# EAGLE design shield-i2c-santa (EAGLE 6.5.0)
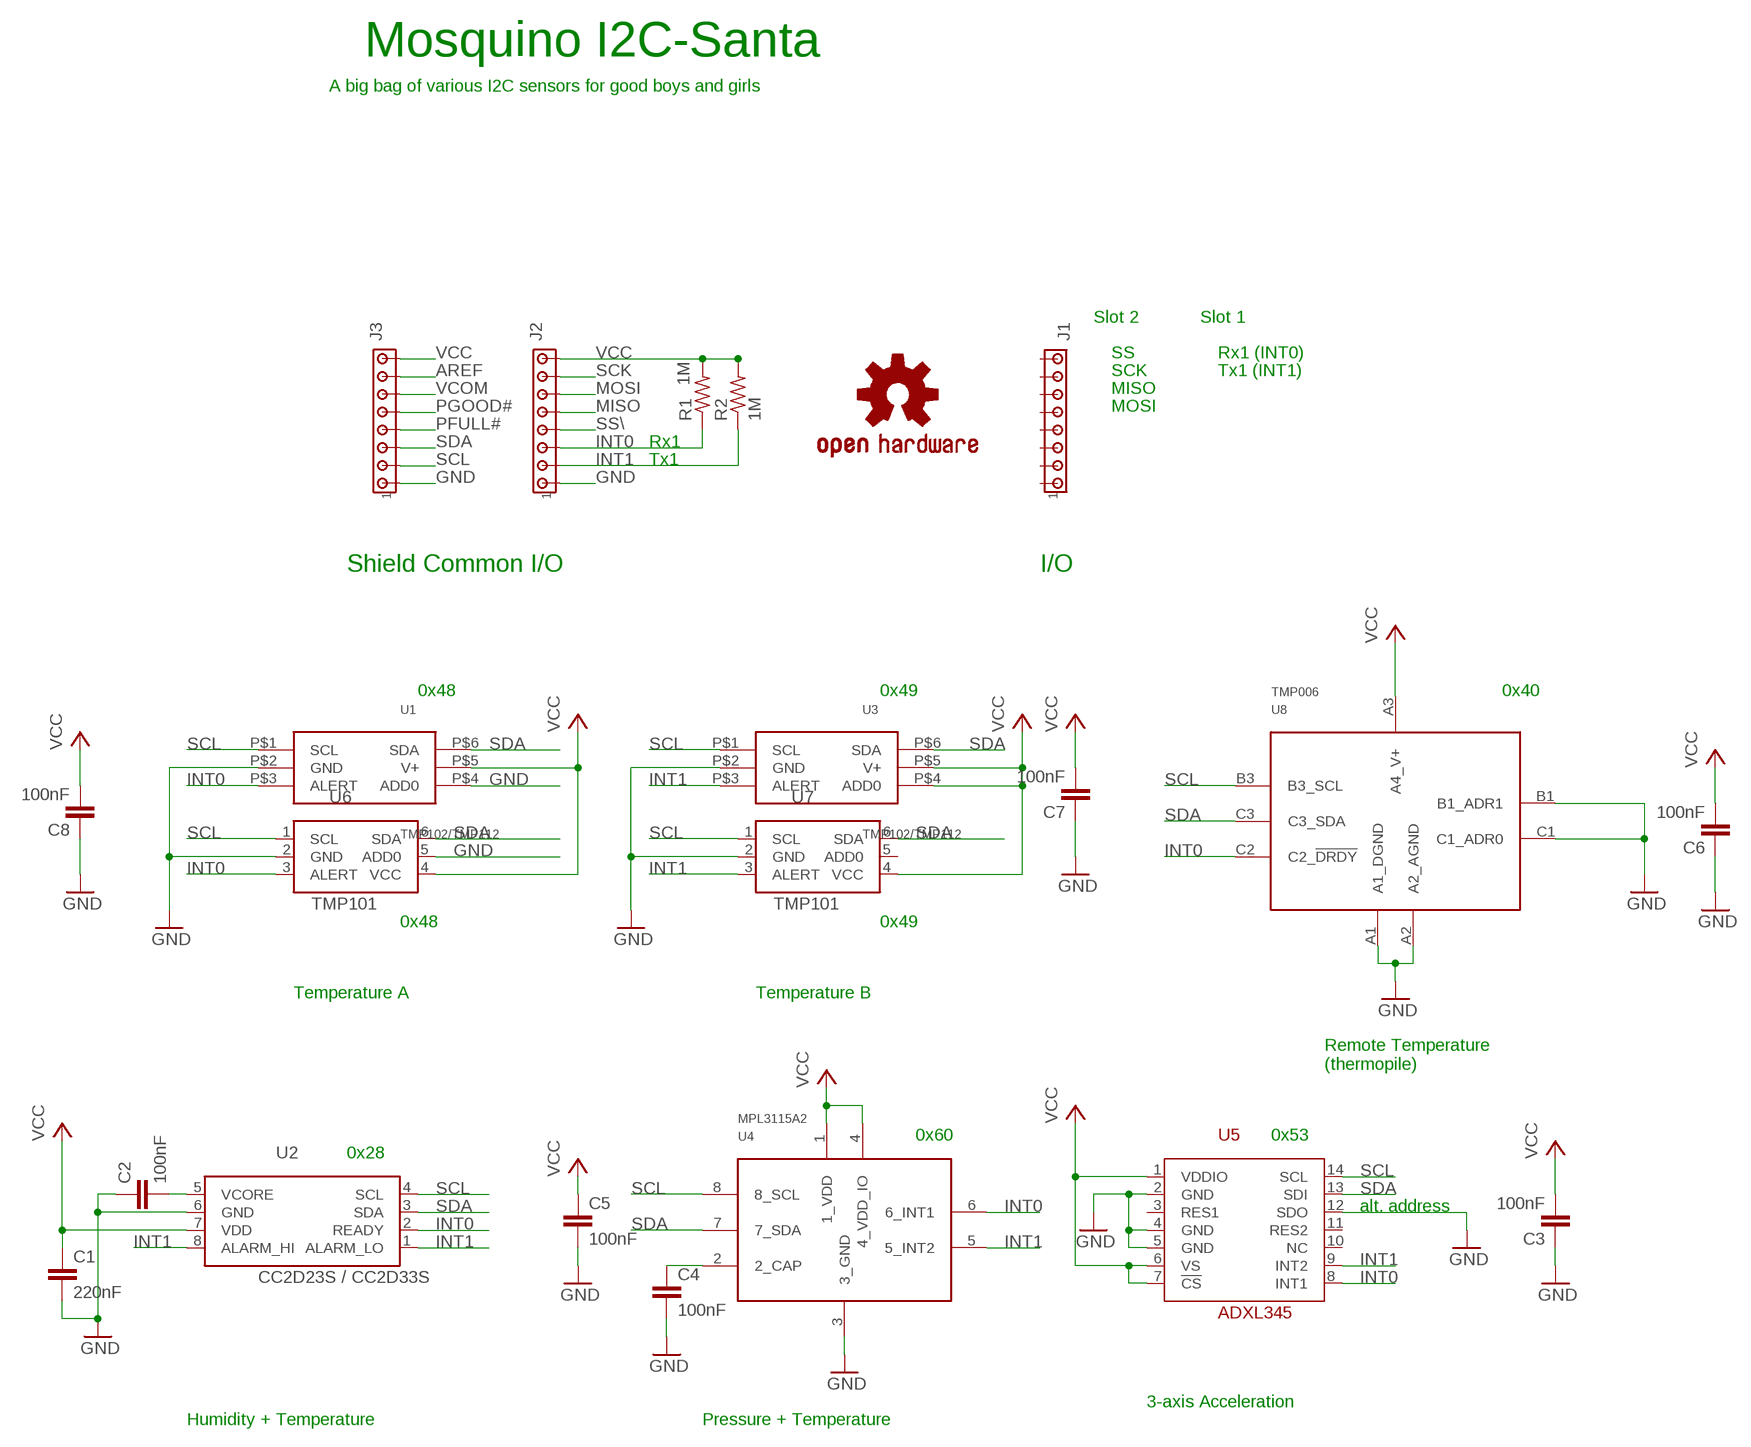
[diagram p0: schematic, sheet 1]

## Parts
C1  220nF  C-EUC0603  [C0603]
C2  100nF  C-EUC0603  [C0603]
C3  100nF  C-EUC0603  [C0603]
C4  100nF  C-EUC0603  [C0603]
C5  100nF  C-EUC0603  [C0603]
C6  100nF  C-EUC0603  [C0603]
C7  100nF  C-EUC0603  [C0603]
C8  100nF  C-EUC0603  [C0603]
J1  MTA08-100  [10X08MTA]
J2  MTA08-100  [10X08MTA]
J3  MTA08-100  [10X08MTA]
LOGO1  OSHW-LOGOS  [OSHW-LOGO-S]
R1  1M  R-US_R0603  [R0603]
R2  1M  R-US_R0603  [R0603]
U1  TMP102/TMP112  TMP102  [SOT563]
U2  CC2D23S / CC2D33S  CC2DXXX  [CC2DXXX]
U3  TMP102/TMP112  TMP102  [SOT563]
U4  MPL3115A2  [8-LGA]
U5  ADXL345  [14-LGA]
U6  TMP101  [SOT23-6]
U7  TMP101  [SOT23-6]
U8  TMP006  [8-DSBGA]

## Nets
AREF: J3.7
GND: C1.2 C2.1 C3.1 C4.2 C5.2 C6.1 C7.1 C8.1 J2.1 J3.1 U1.P$2(GND) U1.P$4(ADD0) U2.6(GND) U3.P$2(GND) U4.3(3_GND) U5.2(GND) U5.4(GND) U5.5(GND) U5.12(SDO) U6.2(GND) U6.5(ADD0) U7.2(GND) U8.A1(A1_DGND) U8.A2(A2_AGND) U8.B1(B1_ADR1) U8.C1(C1_ADR0)
INT0: J2.3 R1.1 U1.P$3(ALERT) U2.2(READY) U4.6(6_INT1) U5.8(INT1) U6.3(ALERT) U8.C2(C2_!DRDY)
INT1: J2.2 R2.1 U2.1(ALARM_LO) U2.8(ALARM_HI) U3.P$3(ALERT) U4.5(5_INT2) U5.9(INT2) U7.3(ALERT)
MISO: J2.5
MOSI: J2.6
N$1: C2.2 U2.5(VCORE)
N$2: C4.1 U4.2(2_CAP)
PFULL#: J3.4
PGOOD#: J3.5
SCK: J2.7
SCL: J3.2 U1.P$1(SCL) U2.4(SCL) U3.P$1(SCL) U4.8(8_SCL) U5.14(SCL) U6.1(SCL) U7.1(SCL) U8.B3(B3_SCL)
SDA: J3.3 U1.P$6(SDA) U2.3(SDA) U3.P$6(SDA) U4.7(7_SDA) U5.13(SDI) U6.6(SDA) U7.6(SDA) U8.C3(C3_SDA)
SS\: J2.4
VCC: C1.1 C3.2 C5.1 C6.2 C7.2 C8.2 J2.8 J3.8 R1.2 R2.2 U1.P$5(V+) U2.7(VDD) U3.P$4(ADD0) U3.P$5(V+) U4.1(1_VDD) U4.4(4_VDD_IO) U5.1(VDDIO) U5.6(VS) U5.7(!CS) U6.4(VCC) U7.4(VCC) U8.A3(A4_V+)
VCOM: J3.6
Unconnected: J1.1 J1.2 J1.3 J1.4 J1.5 J1.6 J1.7 J1.8 U5.3(RES1) U5.10(NC) U5.11(RES2) U7.5(ADD0)

## Notes on the sheet
- Mosquino I2C-Santa
- A big bag of various I2C sensors for good boys and girls
- Slot 2 | Slot 1
- SS | Rx1 (INT0)
- SCK | Tx1 (INT1)
- MISO
- MOSI
- Rx1
- Tx1
- Shield Common I/O | I/O
- 0x48 | 0x49 | 0x40
- 0x48 | 0x49
- Temperature A | Temperature B
- Remote Temperature
  (thermopile)
- 0x60 | 0x53
- 0x28
- alt. address
- 3-axis Acceleration
- Humidity + Temperature | Pressure + Temperature

## Library data of the parts
C1-C8 = rcl:C-EU: CAPACITOR, European symbol
J1-J3 = con-amp:MTA08-100: AMP connector
LOGO1 = SparkFun-Aesthetics:OSHW-LOGO: Open Source Hardware Logo This logo indicates the piece of hardware it is found on incorporates a OSHW license and/or adheres to the definition of open source hardware found here: http://freedomdefined.org/OSHW
R1 R2 = rcl:R-US_: RESISTOR, American symbol
U1 U3 = tim:TMP102
U2 = tim:CC2DXXX: GE ChipCap series humidity and temperature sensor. 20130911 / tgipson
U4 = tim:MPL3115A2: MPL3115A2 I2C Precision Altimeter Freescale Semiconductor 2013.1.24 MMB
U5 = tim:ADXL345: ADXL345 3-axis digital accelerometer . selectable 2g to 16g scale . in 14-LGA. 20091026 / tgipson
U6 U7 = tim:TMP101: TI TMP100 / TMP101 digital I2C temperature sensor in SOT23-6. 20130912 / tgipson
U8 = tim:TMP006: 8-DSBGA for TI TMP006 Thermopile temperature sensor WARNING - This part requires very specific routing, refer to the following for guidelines: <http://www.ti.com/lit/ug/sbou108/sbou108.pdf> 2013.1.24 MMB

## Net classes
1 pwr: width 0.305 mm, drill 0.508 mm, clearance 0.203 mm
4 digital: width 0.203 mm, drill 0.381 mm, clearance 0.203 mm

## Board
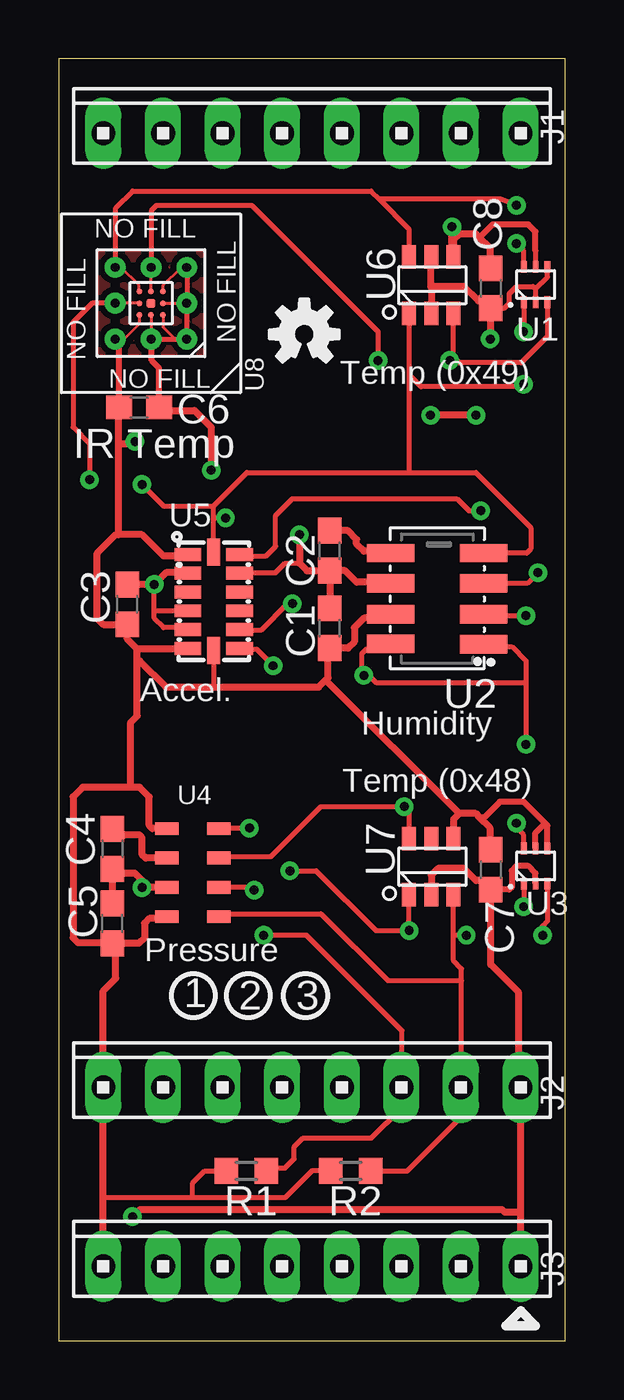
[diagram p1: board, top side]
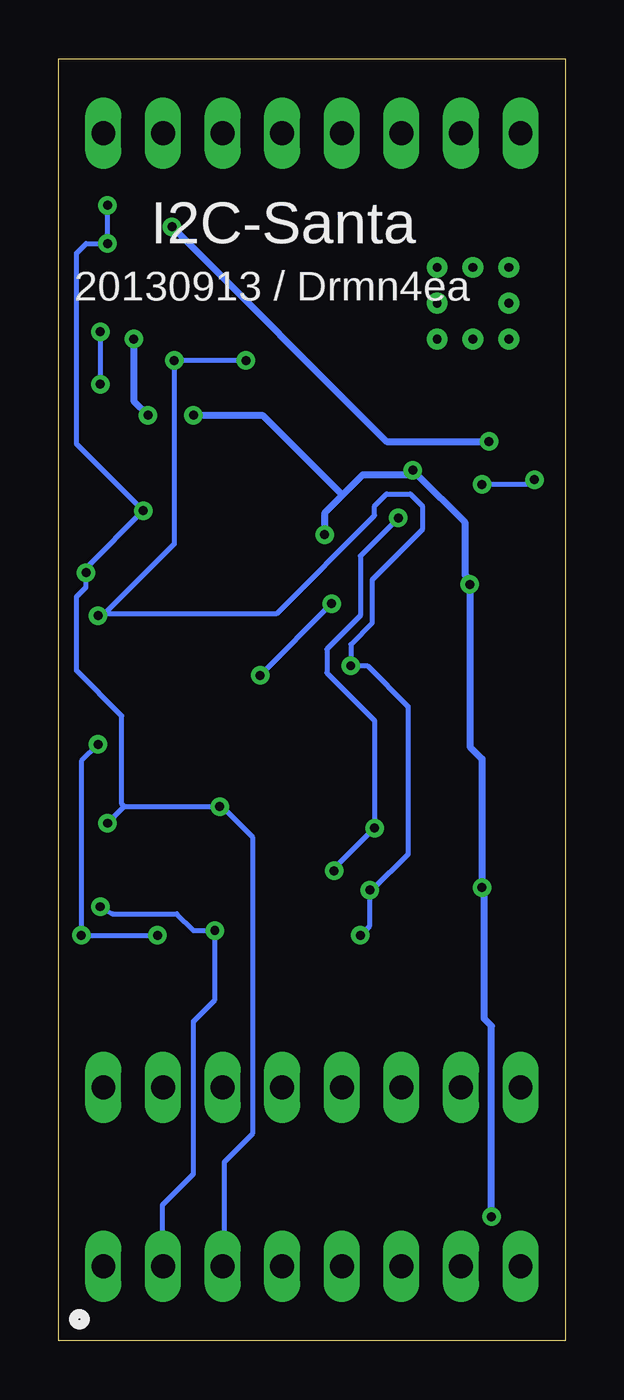
[diagram p2: board, bottom side, seen from below]

Size 21.59 x 54.61 mm. Coordinates in mm from the lower left corner, seen from the top.
Outline: 0,0 21.59,0 21.59,54.61 0,54.61 0,0
Copper layers (1*16): Top 0.035mm / dielectric 1.5mm / Bottom 0.035mm
Design rules "default *": minimum track width 8mil, minimum drill 15mil, track to track 10mil, track to pad 10mil, pad to pad 10mil, via to via 10mil, smd to smd 8mil, copper to edge 15mil, drill to drill 8mil, minimum pad ring 10mil, minimum via ring 8mil, stop-mask expansion 4mil, vias tented up to drill 0mil, thermal gap 10mil

### Footprints (pad centres in the part's own frame; a part is rotated, then mirrored left to right if it is on the bottom)
C0603 = smd 1.1 x 1: 1 -0.85,0; 2 0.85,0
10X08MTA = drill 1.016 long: 1 8.89,0; 2 6.35,0; 3 3.81,0; 4 1.27,0; 5 -1.27,0; 6 -3.81,0; 7 -6.35,0; 8 -8.89,0
R0603 = smd 1 x 1.1: 1 -0.85,0; 2 0.85,0
SOT563 = smd 0.25 x 0.5: P$1 -0.497,-0.718; P$2 0.003,-0.718; P$3 0.503,-0.718; P$4 0.503,0.782; P$5 0.003,0.782; P$6 -0.497,0.782
CC2DXXX = smd 2.007 x 0.787: 1 1.981,-1.956; 2 1.981,-0.686; 3 1.981,0.635; 4 1.981,1.93; 5 -1.981,1.93; 6 -1.981,0.635; 7 -1.981,-0.686; 8 -1.981,-1.93
8-LGA = smd 1 x 0.55: 1 -1.1,1.875; 2 -1.1,0.625; 3 -1.1,-0.625; 4 -1.1,-1.875; 5 1.1,-1.875; 6 1.1,-0.625; 7 1.1,0.625; 8 1.1,1.875
14-LGA = smd 1.145 x 0.55: 1 -1.1,2; 2 -1.1,1.2; 3 -1.1,0.4; 4 -1.1,-0.4; 5 -1.1,-1.2; 6 -1.1,-2; 8 1.1,-2; 9 1.1,-1.2; 10 1.1,-0.4; 11 1.1,0.4; 12 1.1,1.2; 13 1.1,2 | smd 0.55 x 1.145: 7 0,-2.1; 14 0,2.1
SOT23-6 = smd 0.6 x 1: 1 -0.95,-1.2; 2 0,-1.2; 3 0.95,-1.2; 4 0.95,1.2; 5 0,1.2; 6 -0.95,1.2
8-DSBGA = smd 0.635 x 0.635: A1 1.562,-1.521; A2 0,-1.527; A3 -1.532,-1.542; B1 1.539,0.008; B3 -1.527,-0.013; C1 1.547,1.539; C2 0.01,1.529; C3 -1.524,1.532 | smd 0.254 x 0.254: A1_ 0.5,-0.5; A2_ 0,-0.5; A3_ -0.5,-0.5; B1_ 0.5,0; B3_ -0.5,0; C1_ 0.5,0.5; C2_ 0,0.5; C3_ -0.5,0.5 | smd 0.381 x 0.381: B2_ 0,0 | drill 0.381 pad 0.762: VIA_A1 1.524,-1.524; VIA_A2 0,-1.524; VIA_A3 -1.524,-1.524; VIA_B1 1.524,0; VIA_B3 -1.524,0; VIA_C1 1.524,1.524; VIA_C2 0,1.524; VIA_C3 -1.524,1.524

### Placement (x,y rotation side)
C1  11.56,30.35 90 top
C2  11.56,33.66 90 top
C3  2.92,31.37 270 top
C4  2.29,20.95 270 top
C5  2.29,17.78 90 top
C6  3.43,39.75 180 top
C7  18.41,20.07 90 top
C8  18.41,44.83 90 top
J1  10.79,51.44 0 top
J2  10.79,10.79 0 top
J3  10.79,3.17 0 top
LOGO1  10.46,42.88 0 top
R1  8,7.24 180 top
R2  12.45,7.24 180 top
U1  20.32,44.96 0 top
U2  16.13,31.62 0 top
U3  20.32,20.19 0 top
U4  5.71,19.94 0 top
U5  6.6,31.5 0 top
U6  15.88,44.96 0 top
U7  15.88,20.19 0 top
U8  3.94,44.2 0 top

### Tracks (layer width: path | path; a pad name or v marks a point on that pad's centre or on a via)
GND  (via drill 0.38)
  Top 0.203: U5.5 5.42,30.38 4.47,30.38 4.08,30.77 4.08,31.09 | 4.08,31.09 v4.08,32.22 | U5.4 4.08,31.09 | U1.P$2 20.32,44.8 20.32,44.81 | 20.32,44.81 20.82,45.31 U1.P$4 | C8.1 18.43,43.99 19,43.99 19.2,44.2 19.2,44.6 19.51,44.91 20.22,44.91 20.32,44.81 | U5.12 7.72,32.72 9.25,32.72 9.65,33.12 10.26,33.12 | 3.96,42.64 3.99,42.67 U8.A1 5.48,42.7 U8.B1 U8.C1
  Top 0.254: U3.P$2 20.32,19.91 20.02,20.22 19.51,20.22 19.3,20.02 19.3,19.3 19.19,19.22 C7.1 | C6.1 4.28,41.44 3.96,41.76 3.96,42.64 U8.A2
  Top 0.305: U4.3 3.85,19.31 3.61,19.56 | 3.61,19.56 3.25,19.91 2.73,19.91 | 2.73,19.91 C4.2 | 2.73,19.91 2.29,19.72 C5.2 | U7.2 15.88,19.84 16.15,20.12 17.27,20.12 17.78,19.61 18.02,19.61 C7.1 18.41,16.03 19.61,14.83 19.61,10.87 J2.1 19.68,5.49 | U5.2 5.49,32.72 4.57,32.72 v4.08,32.22 C3.1 | U2.6 14.1,32.31 12.7,32.31 12.2,32.8 C2.1 | C2.1 C1.2 | 16.05,44.91 17.27,44.91 17.88,44.3 18.1,44.3 C8.1 18.41,42.7 v18.39,42.67 | 16.05,44.91 15.88,44.73 U6.2 | U6.5 15.85,46.13 15.85,44.91 16.05,44.91 | J3.1 19.68,5.49 | 19.68,5.49 19,5.49 18.9,5.59 3.45,5.59 v3.15,5.28 | v3.56,19.3 3.61,19.56 | v10.26,34.34 10.26,33.12 10.58,32.8 C2.1 | C6.1 4.41,39.62 5.79,39.62 6.5,38.91 v6.5,37.08 | v17.78,39.42 v15.85,39.42
  Bottom 0.305: v3.15,5.28 3.15,13.41 3.45,13.72 3.45,19.2 v3.56,19.3 3.56,24.79 4.06,25.3 4.06,32.21 v4.08,32.22 4.08,32.42 4.27,32.61 4.27,34.85 6.3,36.88 6.5,36.88 | 6.5,36.88 8.64,36.88 9.5,36.02 | 9.5,36.02 10.26,35.26 v10.26,34.34 | v6.5,37.08 6.5,36.88 | v18.39,42.67 18.39,40.03 v17.78,39.42 | v15.85,39.42 12.9,39.42 9.5,36.02
  pour Top: 1.73,46.33 1.73,42.06 6.1,42.06 6.1,46.33
INT0  (via drill 0.38)
  Top 0.203: R1.1 8.98,7.37 9.65,7.37 10.03,7.75 10.03,8.26 10.41,8.64 13.34,8.64 14.61,9.91 J2.3 14.63,10.82 14.63,13.21 10.57,17.27 v8.74,17.27 | v8.33,19.2 8.22,19.31 U4.6 | U5.8 7.74,29.46 8.43,29.46 v9.14,28.75 | U2.2 18.16,30.89 v19.91,30.89 | U8.C2 3.96,45.74 3.96,48.16 4.17,48.36 8.23,48.36 13.61,42.98 v13.61,41.76 | U1.P$3 20.83,42.77 19.71,41.66 17.07,41.66 16.82,41.9 | 16.82,41.9 U6.3 | 16.82,41.9 16.68,41.76 v16.66,41.76
  Bottom 0.203: v8.74,17.27 8.33,17.68 v8.33,19.2 8.23,19.2 6.71,20.73 6.71,27.03 8.43,28.75 v9.14,28.75 9.14,29.67 8.23,30.58 8.23,32.41 6.1,34.54 6.1,35.56 6.6,36.07 7.62,36.07 8.13,35.56 8.13,35.15 12.29,30.99 19.81,30.99 v19.91,30.89 19.71,30.89 16.66,33.93 v16.66,41.76 v13.61,41.76
INT1  (via drill 0.38)
  Top 0.203: R2.1 14.86,7.24 17.14,9.53 J2.2 17.17,10.82 17.17,15.34 | 17.17,15.34 17.17,15.85 16.82,16.2 16.82,17.27 | 16.82,17.27 U7.3 | U3.P$3 20.83,17.88 20.62,17.68 v20.62,17.27 | v17.37,17.27 16.82,17.27 | U4.5 6.94,18.19 11.18,18.19 14.02,15.34 17.17,15.34 | U2.1 18.21,29.57 19.3,29.57 19.91,28.96 19.91,28.04 | 19.91,28.04 v19.91,25.4 | U2.8 13.92,29.46 13.11,29.46 12.9,29.26 12.9,28.65 13.01,28.55 | 13.01,28.55 13.51,28.04 19.91,28.04 | U5.9 7.72,30.28 8.64,30.28 9.75,31.39 v9.96,31.39 | 13.01,28.55 v13.01,28.35
  Bottom 0.203: v17.37,17.27 v20.62,17.27 20.62,24.69 v19.91,25.4 | v9.96,31.39 v13.01,28.35
N$1
  Top 0.305: U2.5 14.07,33.63 13.01,33.63 12.7,33.93 12.7,34.14 12.33,34.51 C2.2
N$2
  Top 0.305: U4.2 3.72,20.56 3.56,20.73 3.56,21.44 3.45,21.54 2.81,21.54 C4.1
SCL  (via drill 0.38)
  Top 0.203: U7.1 14.93,17.48 v14.94,17.48 13.51,17.48 10.97,20.02 v9.86,20.02 | U4.8 6.84,21.84 v8.13,21.84 | U3.P$1 19.81,19.46 v19.81,18.49 | U5.14 6.6,35.05 | 6.6,35.05 6.6,35.56 | 6.6,35.56 8.03,36.98 14.94,36.98 | 14.94,36.98 17.78,36.98 20.12,34.65 20.12,33.73 19.94,33.55 U2.4 | U8.B3 2.4,44.2 1.42,44.2 0.61,43.38 0.61,38.91 1.32,38.2 v1.32,36.68 | v3.56,36.47 4.47,35.56 6.6,35.56 | U6.1 14.94,43.75 14.94,41.15 | 14.94,41.15 14.94,36.98 | U1.P$1 19.81,44.23 v19.81,42.98 | v19.81,40.74 19.71,40.64 15.44,40.64 14.94,41.15 | v7.11,35.05 6.6,35.05
  Bottom 0.203: J3.2 17.17,3.2 17.17,5.79 15.85,7.11 15.85,13.61 14.94,14.53 v14.94,17.48 15.85,17.48 16.56,18.19 19.3,18.19 v19.81,18.49 | v9.86,20.02 9.86,20.12 v8.13,21.84 8.13,26.42 10.16,28.45 10.16,29.46 8.74,30.89 8.74,33.43 v7.11,35.05 | v1.32,36.68 1.52,36.47 v3.56,36.47 | v19.81,42.98 v19.81,40.74
SDA  (via drill 0.38)
  Top 0.203: U7.6 14.93,22.57 v14.73,22.76 11.18,22.76 9.04,20.62 6.88,20.62 U4.7 | U3.P$6 19.81,21.54 19.51,21.84 v19.51,22.05 | U5.13 7.77,33.43 8.84,33.43 9.25,33.83 9.25,35.15 9.96,35.87 16.97,35.87 17.48,35.36 v17.98,35.36 | v20.42,32.72 19.96,32.26 U2.3 | U8.C3 2.44,45.75 2.44,48.26 3.15,48.97 13.31,48.97 13.66,48.62 | 13.66,48.62 14.93,47.36 U6.6 | U1.P$6 19.81,45.75 19.81,46.43 v19.51,46.74 | v19.51,48.36 18.85,48.62 13.66,48.62
  Bottom 0.203: J3.3 14.53,3.25 14.53,7.62 13.31,8.84 13.31,21.44 14.63,22.76 v14.73,22.76 18.8,22.76 | v19.51,22.05 18.8,22.76 | 18.8,22.76 18.9,22.86 18.9,26.62 20.83,28.55 20.83,31.7 20.42,32.11 v20.42,32.72 20.42,32.92 v17.98,35.36 20.83,38.2 20.83,46.33 20.42,46.74 v19.51,46.74 v19.51,48.36
VCC  (via drill 0.38)
  Top 0.203: U1.P$5 20.32,46.43 | U5.7 6.6,27.84 | R2.2 10.79,7.24 9.65,6.1 5.69,6.1 | 5.69,6.1 1.91,6.1 | R1.2 7.13,7.21 6.2,7.21 5.69,6.71 5.69,6.1
  Top 0.254: U3.P$4 20.83,21.95 20.68,22.1 | 20.68,22.1 19.81,22.96 18.8,22.96 18.14,22.3 17.93,22.3 | U3.P$5 20.32,21.64 20.68,22 20.68,22.1 | 20.32,46.43 20.32,47.24 20.02,47.55 18.49,47.55 17.93,46.99 | C6.2 2.58,42.48 U8.A3
  Top 0.305: U4.4 4.53,17.98 3.86,17.98 3.66,17.78 3.66,17.17 3.42,16.93 C5.1 | C7.2 18.39,20.94 18.39,21.84 17.93,22.3 17.78,22.45 17.07,22.45 | 17.07,22.45 16.82,22.21 U7.4 | U5.6 5.47,29.46 3.35,29.46 | 3.35,29.46 2.92,29.9 C3.2 1.89,30.52 1.63,30.79 1.63,33.53 2.44,34.34 2.54,34.34 | U5.1 5.43,33.43 4.47,33.43 3.56,34.34 2.54,34.34 | U2.7 13.99,30.79 13.01,30.79 12.6,30.38 12.6,29.77 12.33,29.5 C1.1 11.48,29.43 11.48,28.25 11.38,28.14 | C8.2 18.39,45.71 18.39,46.53 17.93,46.99 17.78,47.14 17.07,47.14 16.82,46.9 U6.4 16.76,46.22 v16.76,47.45 | J3.8 1.91,6.1 J2.8 1.91,14.91 2.44,15.44 2.44,16.83 C5.1 | U4.1 3.99,21.81 3.86,21.95 3.86,23.16 3.45,23.57 3.05,23.57 | 3.05,23.57 1.02,23.57 0.61,23.16 0.61,17.17 0.81,16.97 2.5,16.97 C5.1 | 11.38,28.14 11.07,27.84 6.6,27.84 4.57,27.84 3.45,28.96 3.35,28.96 | 3.05,23.57 3.05,26.31 3.35,26.62 3.35,28.96 | 3.35,28.96 3.35,29.46 | C6.2 2.54,39.71 2.54,38.2 | 2.54,38.2 2.54,34.34 | v3.25,38.3 2.95,38.2 2.54,38.2 | 17.07,22.45 11.38,28.14
  Bottom 0.305: v16.76,47.45 7.62,38.3 v3.25,38.3

### Text on the board
tPlace: Temp (0x49) | IR Temp | Accel. | Humidity | Temp (0x48) | Pressure
bPlace: I2C-Santa | 20130913 / Drmn4ea
tNames: 1 | 2 | 3
Reference: Vcc | INT0 | INT1 | Gnd | Vcc | SDA | SCL | Gnd